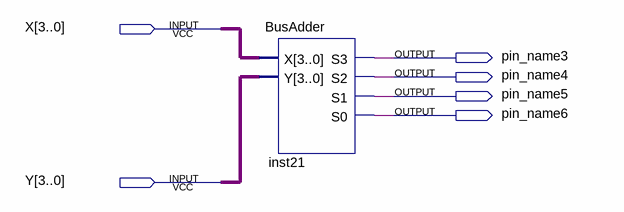
[diagram p0: schematic sheet]
// Quartus schematic try2.bdf as structural Verilog: 1 symbols, 6 pins
module try2 (
  input  [3:0] X,
  input  [3:0] Y,
  output pin_name3,
  output pin_name4,
  output pin_name5,
  output pin_name6
);

  BusAdder inst21 (.X(X), .Y(Y), .S3(pin_name3), .S2(pin_name4), .S1(pin_name5), .S0(pin_name6));
endmodule
